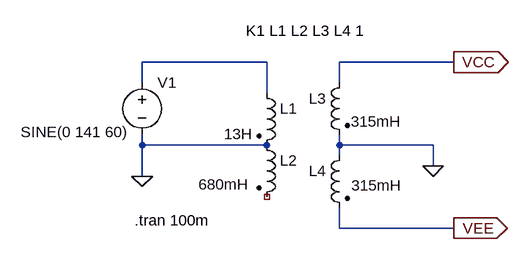
[diagram p0: schematic Toroidal Trans  HDB-12(L).asc]
Toroidal Trans  HDB-12(L).asc, the LTspice schematic file:
Version 4
SHEET 1 880 680
WIRE 288 64 96 64
WIRE 576 64 400 64
WIRE 96 96 96 64
WIRE 400 96 400 64
WIRE 288 112 288 64
WIRE 96 192 96 176
WIRE 288 192 96 192
WIRE 400 192 400 176
WIRE 544 192 400 192
WIRE 400 208 400 192
WIRE 544 224 544 192
WIRE 96 240 96 192
WIRE 400 320 400 288
WIRE 576 320 400 320
FLAG 96 240 0
FLAG 544 224 0
FLAG 576 64 VCC
IOPIN 576 64 Out
FLAG 576 320 VEE
IOPIN 576 320 Out
SYMBOL ind2 272 96 R0
WINDOW 3 -50 79 Left 2
SYMATTR InstName L1
SYMATTR Value 13H
SYMATTR SpiceLine Rser=2.8k
SYMBOL ind2 272 176 R0
WINDOW 3 -89 77 Left 2
SYMATTR InstName L2
SYMATTR Value 680mH
SYMATTR SpiceLine Rser=169
SYMBOL ind2 416 80 M0
WINDOW 3 -79 76 Left 2
SYMATTR InstName L3
SYMATTR Value 315mH
SYMATTR SpiceLine Rser=77
SYMBOL ind2 416 192 M0
WINDOW 3 -80 62 Left 2
SYMATTR InstName L4
SYMATTR Value 315mH
SYMATTR SpiceLine Rser=77
SYMBOL voltage 96 80 R0
WINDOW 3 -187 92 Left 2
WINDOW 123 0 0 Left 2
WINDOW 39 0 0 Left 2
SYMATTR InstName V1
SYMATTR Value SINE(0 141 60)
TEXT 256 16 Left 2 !K1 L1 L2 L3 L4 1
TEXT 84 308 Left 2 !.tran 100m

The netlist it stands for:
* Toroidal Trans  HDB-12(L).asc
L1 N001 0 13H Rser=2.8k
L2 0 NC_01 680mH Rser=169
L3 VCC 0 315mH Rser=77
L4 0 VEE 315mH Rser=77
V1 N001 0 SINE(0 141 60)
K1 L1 L2 L3 L4 1
.tran 100m
.backanno
.end